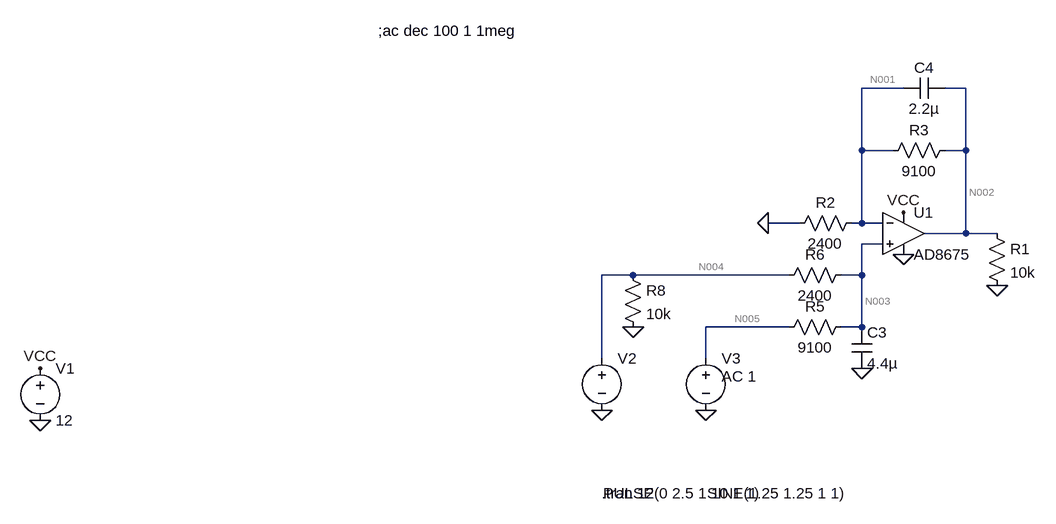
[diagram p0: schematic OffsetAmplifier.asc]
OffsetAmplifier.asc, the LTspice schematic file:
Version 4
SHEET 1 880 680
WIRE 432 -176 368 -176
WIRE 528 -176 496 -176
WIRE 368 -80 368 -176
WIRE 416 -80 368 -80
WIRE 528 -80 528 -176
WIRE 528 -80 496 -80
WIRE 272 32 224 32
WIRE 368 32 368 -80
WIRE 368 32 352 32
WIRE 400 32 368 32
WIRE 528 48 528 -80
WIRE 528 48 464 48
WIRE 576 48 528 48
WIRE 400 64 368 64
WIRE 16 112 -32 112
WIRE 256 112 16 112
WIRE 368 112 368 64
WIRE 368 112 336 112
WIRE 256 192 128 192
WIRE 368 192 368 112
WIRE 368 192 336 192
WIRE -32 240 -32 112
WIRE 128 240 128 192
FLAG -896 336 0
FLAG -32 320 0
FLAG 128 320 0
FLAG 432 80 0
FLAG 576 128 0
FLAG 224 32 0
FLAG 432 16 VCC
FLAG 368 256 0
FLAG 16 192 0
FLAG -896 256 VCC
SYMBOL voltage -896 240 R0
WINDOW 123 0 0 Left 0
WINDOW 39 0 0 Left 0
SYMATTR InstName V1
SYMATTR Value 12
SYMBOL voltage -32 224 R0
WINDOW 3 2 224 Left 2
WINDOW 39 0 0 Left 0
SYMATTR Value PULSE(0 2.5 1 10 1 1)
SYMATTR Value2 AC 1
SYMATTR InstName V2
SYMBOL Opamps\\AD8675 432 -16 R0
SYMATTR InstName U1
SYMBOL res 560 32 R0
SYMATTR InstName R1
SYMATTR Value 10k
SYMBOL res 368 16 R90
WINDOW 0 0 56 VBottom 2
WINDOW 3 32 56 VTop 2
SYMATTR InstName R2
SYMATTR Value 2400
SYMBOL res 512 -96 R90
WINDOW 0 0 56 VBottom 2
WINDOW 3 32 56 VTop 2
SYMATTR InstName R3
SYMATTR Value 9100
SYMBOL res 352 176 R90
WINDOW 0 0 56 VBottom 2
WINDOW 3 32 56 VTop 2
SYMATTR InstName R5
SYMATTR Value 9100
SYMBOL res 352 96 R90
WINDOW 0 0 56 VBottom 2
WINDOW 3 32 56 VTop 2
SYMATTR InstName R6
SYMATTR Value 2400
SYMBOL cap 352 192 R0
SYMATTR InstName C3
SYMATTR Value 4.4µ
SYMBOL cap 496 -192 R90
WINDOW 0 0 32 VBottom 2
WINDOW 3 32 32 VTop 2
SYMATTR InstName C4
SYMATTR Value 2.2µ
SYMBOL res 0 96 R0
SYMATTR InstName R8
SYMATTR Value 10k
SYMBOL voltage 128 224 R0
WINDOW 3 2 224 Left 2
WINDOW 123 24 44 Left 2
WINDOW 39 0 0 Left 0
SYMATTR Value SINE(1.25 1.25 1 1)
SYMATTR Value2 AC 1
SYMATTR InstName V3
TEXT -32 448 Left 2 !.tran 12
TEXT -376 -264 Left 2 !;ac dec 100 1 1meg

The netlist it stands for:
* OffsetAmplifier.asc
V1 VCC 0 12
V2 N004 0 PULSE(0 2.5 1 10 1 1) AC 1
XU1 N003 N001 VCC 0 N002 AD8675  ; pins In+ In- V+ V- OUT
R1 N002 0 10k
R2 N001 0 2400
R3 N002 N001 9100
R5 N003 N005 9100
R6 N003 N004 2400
C3 N003 0 4.4µ
C4 N002 N001 2.2µ
R8 N004 0 10k
V3 N005 0 SINE(1.25 1.25 1 1) AC 1
.tran 12
;ac dec 100 1 1meg
.backanno
.end

* Results of the author's LTspice run, read from the files saved beside the schematic
* Operating Point, zero values left out:
*   V(vcc) = 12 V
*   V(n001) = 259.2 mV
*   V(n003) = 260.9 mV
*   V(n002) = 1.242 V
*   V(n005) = 1.25 V
*   I(R6) = 108.7 µA
*   I(R5) = -108.7 µA
*   I(R3) = 108 µA
*   I(R2) = 108 µA
*   I(R1) = 124.2 µA
*   I(V3) = -108.7 µA
*   I(V2) = 108.7 µA
*   I(V1) = -2.419 mA
*   Ix(u1:1) = -511.5 pA
*   Ix(u1:2) = -511.5 pA
*   Ix(u1:3) = 2.419 mA
*   Ix(u1:4) = -2.187 mA
*   Ix(u1:5) = -232.2 µA
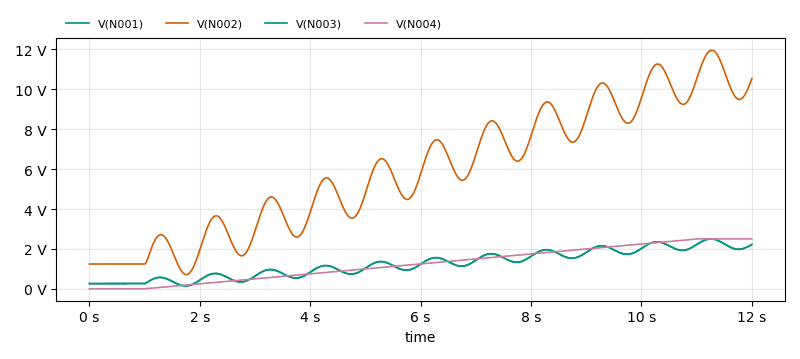
[diagram p1: Transient Analysis of OffsetAmplifier.asc, plotted from the saved traces]
* Transient Analysis, 1 run:
*   V(N001): min 146.5 mV, max 2.499 V, average 1.247 V, rms 1.417 V, last 2.225 V
*   V(N002): min 711 mV, max 11.95 V, average 5.962 V, rms 6.779 V, last 10.54 V
*   V(N003): min 147.2 mV, max 2.5 V, average 1.249 V, rms 1.418 V, last 2.225 V
*   V(N004): min 0 V, max 2.5 V, average 1.25 V, rms 1.502 V, last 2.5 V